# Altium project STCAutoDownload.PrjPCB
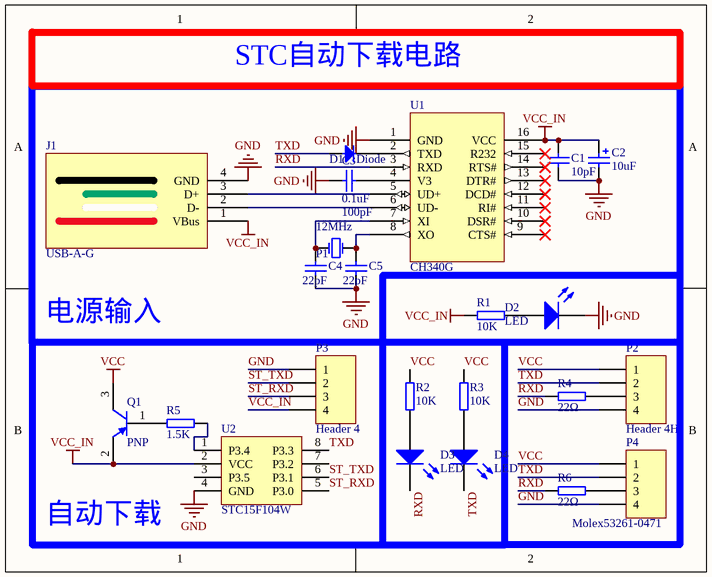
[diagram p0: STCAutoDownload.SchDoc]
1 sheet, 23 parts. Net scope: global (net labels, ports and power ports of the same name join across sheets).
Board file: STCAutoDownload.PcbDoc

## Sheet STCAutoDownload.SchDoc
size 132 x 106 mm

### Parts
C1  10pF  [0603C]
C2  10uF  [钽电容]
C3  0.1uF  value 100pF  [0603C]
C4  22pF  [0603C]
C5  22pF  [0603C]
D1  Diode  [Diode]
D2  LED  [0603LED]
D3  LED  [0603LED]
D4  LED  [0603LED]
J1  USB-A-G  [USB_A_G]
P1  12MHz  [XTAL 12M]
P2  Header 4H  [Header 4]
P3  Header 4  [Header 4]
P4  Molex53261-0471  [Molex53261-0471]
Q1  PNP  [PNP]
R1  10K  [0603R]
R2  10K  [0603R]
R3  10K  [0603R]
R4  22Ω  [0603R]
R5  1.5K  [0603R]
R6  22Ω  [0603R]
U1  CH340G  [CH340G]
U2  STC15F104W  [STC15F104W]

### Nets
GND: C1.1 C2.2 C3.1 C4.1 C5.1 D2.2(K) J1.4(GND) P2.4 P3.1 P4.4 U1.1(GND) U2.4(GND)
VCC: P2.1 P4.1 Q1.3(C) R2.1 R3.1
VCC_IN: C1.2 C2.1 J1.1(VBus) P3.4 Q1.2(E) R1.1 U1.16(VCC) U2.2(VCC)
RXD: D3.2(K) R4.1 R6.1 U1.3(RXD)
ST_RXD: P3.3 U2.5(P3.0)
ST_TXD: P3.2 U2.6(P3.1)
TXD: D1.1(A) D4.2(K) P2.2 P4.2 U2.8(P3.3)
NetC3_2: C3.2 U1.4(V3)
NetC4_2: C4.2 P1.1(OSC1) U1.7(XI)
NetC5_2: C5.2 P1.2(OSC2) U1.8(XO)
NetD1_2: D1.2(K) U1.2(TXD)
NetD2_1: D2.1(A) R1.2
NetD3_1: D3.1(A) R2.2
NetD4_1: D4.1(A) R3.2
NetJ1_2: J1.2(D-) U1.6(UD-)
NetJ1_3: J1.3(D+) U1.5(UD+)
NetP2_3: P2.3 R4.2
NetP4_3: P4.3 R6.2
NetQ1_1: Q1.1(B) R5.1
NetR5_2: R5.2 U2.1(P3.4)

Not connected (* = marked no-connect by the designer): U1 9(CTS#)* 10(DSR#)* 11(RI#)* 12(DCD#)* 13(DTR#)* 14(RTS#)* 15(R232)*; U2 3(P3.5) 7(P3.2)

### Notes on the sheet
- STC自动下载电路
- 电源输入
- 自动下载
- Title
- Size:
- Date:
- A4
- Number:
- Time:
- Revision:
- Sheet
- of
- File:

### Library data of the parts
C1 C4 C5 = 0603C: Capacitor; Value: 100pF; Published: 8-Jun-2000; LatestRevisionDate: 17-Jul-2002; LatestRevisionNote: Re-released for DXP Platform.; PackageReference: RAD-0.3; Publisher: Altium Limited; PackageDescription: Radial Cap, Thru-Hole; 2 Leads; 0.3 in Pin Spacing
C2 = 钽电容: Published: 8-Jun-2000; LatestRevisionDate: 17-Jul-2002; LatestRevisionNote: Re-released for DXP Platform.; PackageReference: RB7.6-15; Publisher: Altium Limited
C3 = 0603C: Capacitor; Published: 8-Jun-2000; LatestRevisionDate: 17-Jul-2002; LatestRevisionNote: Re-released for DXP Platform.; PackageReference: RAD-0.3; Publisher: Altium Limited; PackageDescription: Radial Cap, Thru-Hole; 2 Leads; 0.3 in Pin Spacing
D1 = Diode: 二极管; Published: 8-Jun-2000; LatestRevisionDate: 17-Jul-2002; LatestRevisionNote: Re-released for DXP Platform.; PackageDocument: Sep-1996; PackageReference: SMC; Publisher: Altium Limited; Code_JEDEC: DO-214-AB
D2-D4 = 0603LED: Typical INFRARED GaAs LED; Published: 8-Jun-2000; LatestRevisionDate: 08-Jul-2005; LatestRevisionNote: Mech Layer 1 removed.; PackageReference: LED-0; Publisher: Altium Limited; PackageDescription: LED; 2 Leads
J1 = USB-A-G: USB-A 插头
P1 = XTAL 12M: 12MHZ振荡器[2PIN]
P2 = Header 4H: Header, 4-Pin; LatestRevisionDate: 17-Jul-2002; LatestRevisionNote: Re-released for DXP Platform.; Publisher: Altium Limited
P3 = Header 4: Header, 4-Pin; LatestRevisionDate: 17-Jul-2002; LatestRevisionNote: Re-released for DXP Platform.; Publisher: Altium Limited
P4 = Molex53261-0471: Header, 4-Pin, Molex53261-0471; LatestRevisionDate: 17-Jul-2002; LatestRevisionNote: Re-released for DXP Platform.; Publisher: Altium Limited
Q1 = PNP: PNP Bipolar Transistor; Published: 8-Jun-2000; LatestRevisionDate: 17-Jul-2002; LatestRevisionNote: Re-released for DXP Platform.; PackageReference: SOT-23B; Publisher: Altium Limited; Code_JEDEC: SOT-23
R1-R6 = 0603R: 电阻
U1 = CH340G: USB to TTL Serial / UART